# Altium project Skayboard.PrjPcb
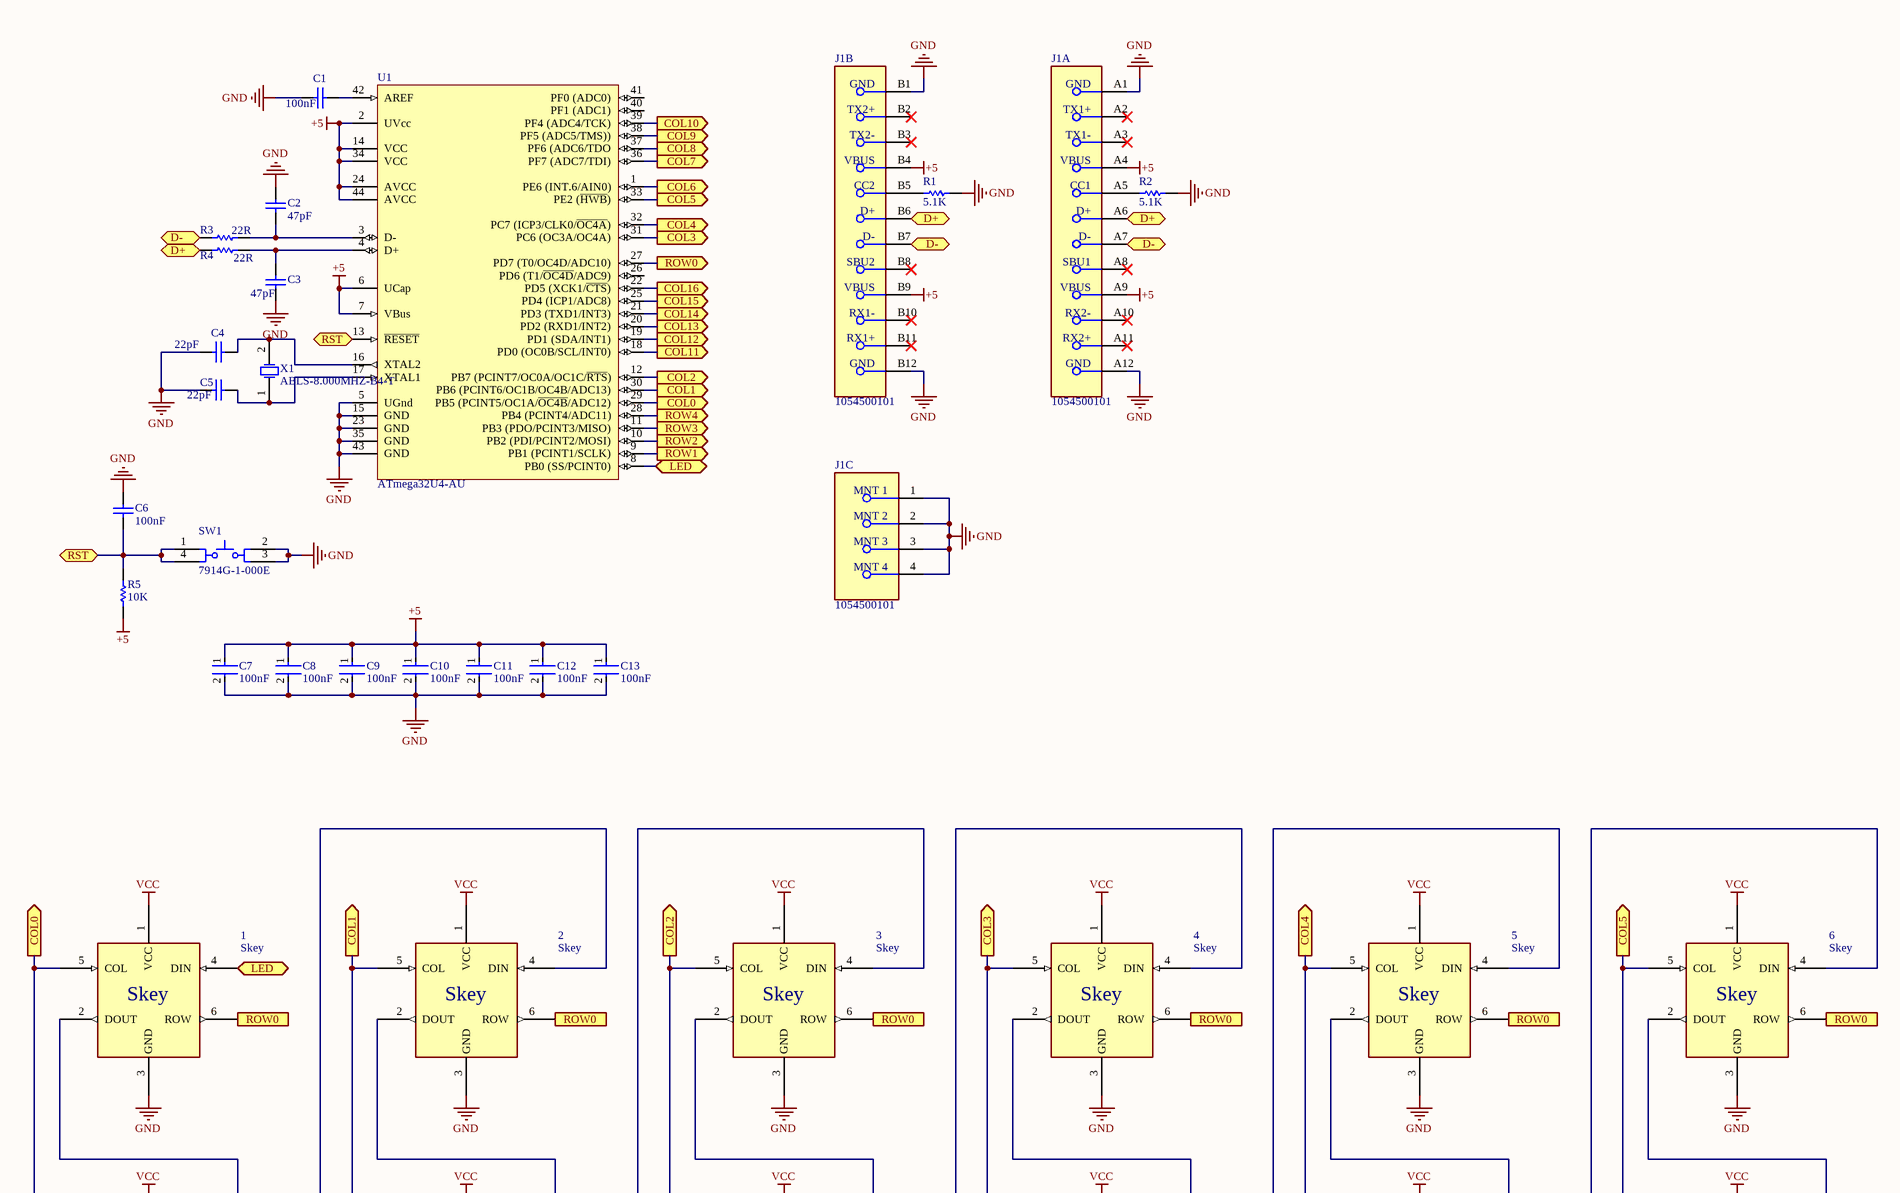
[diagram p0: SkayboardRev2.SchDoc, top left]
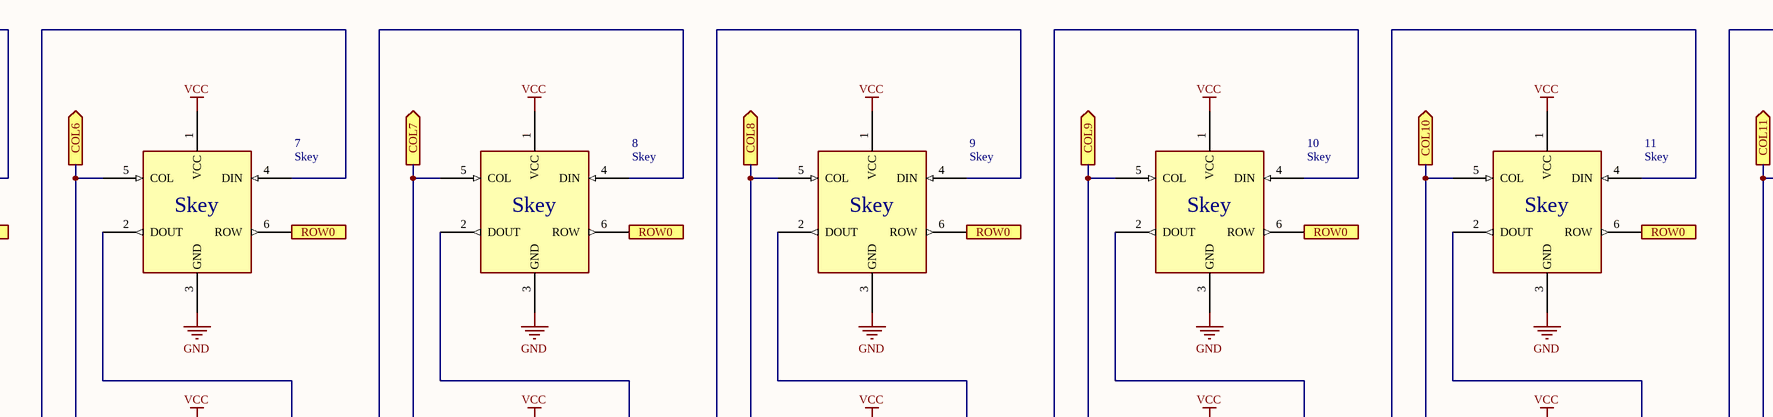
[diagram p1: SkayboardRev2.SchDoc, top middle]
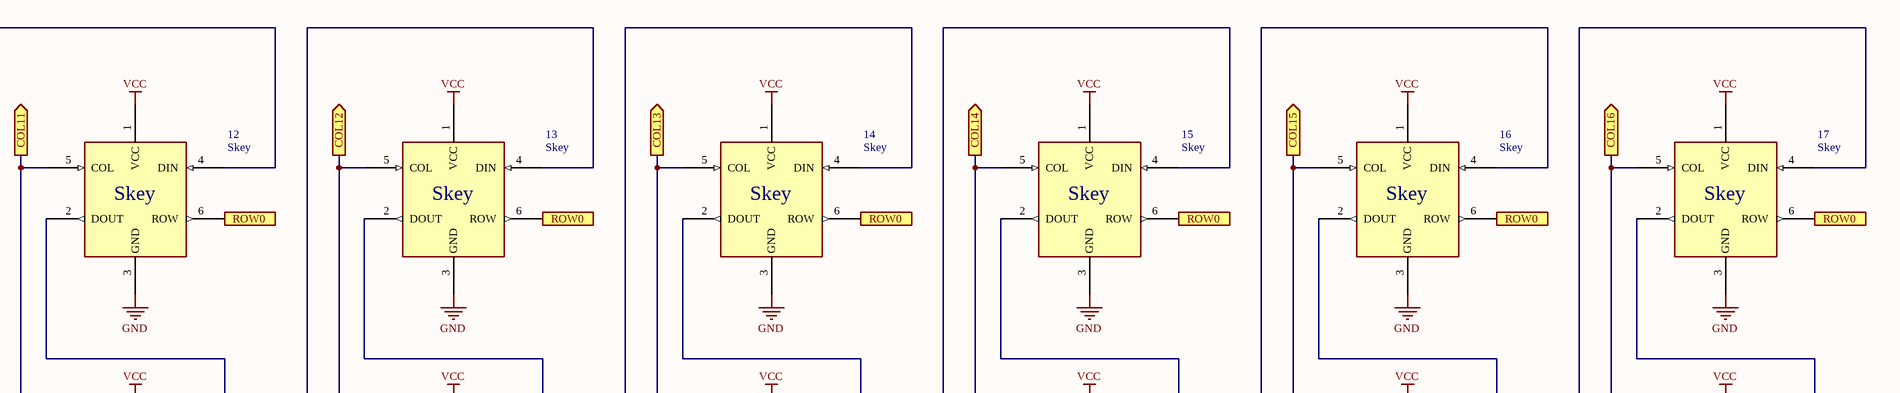
[diagram p2: SkayboardRev2.SchDoc, top right]
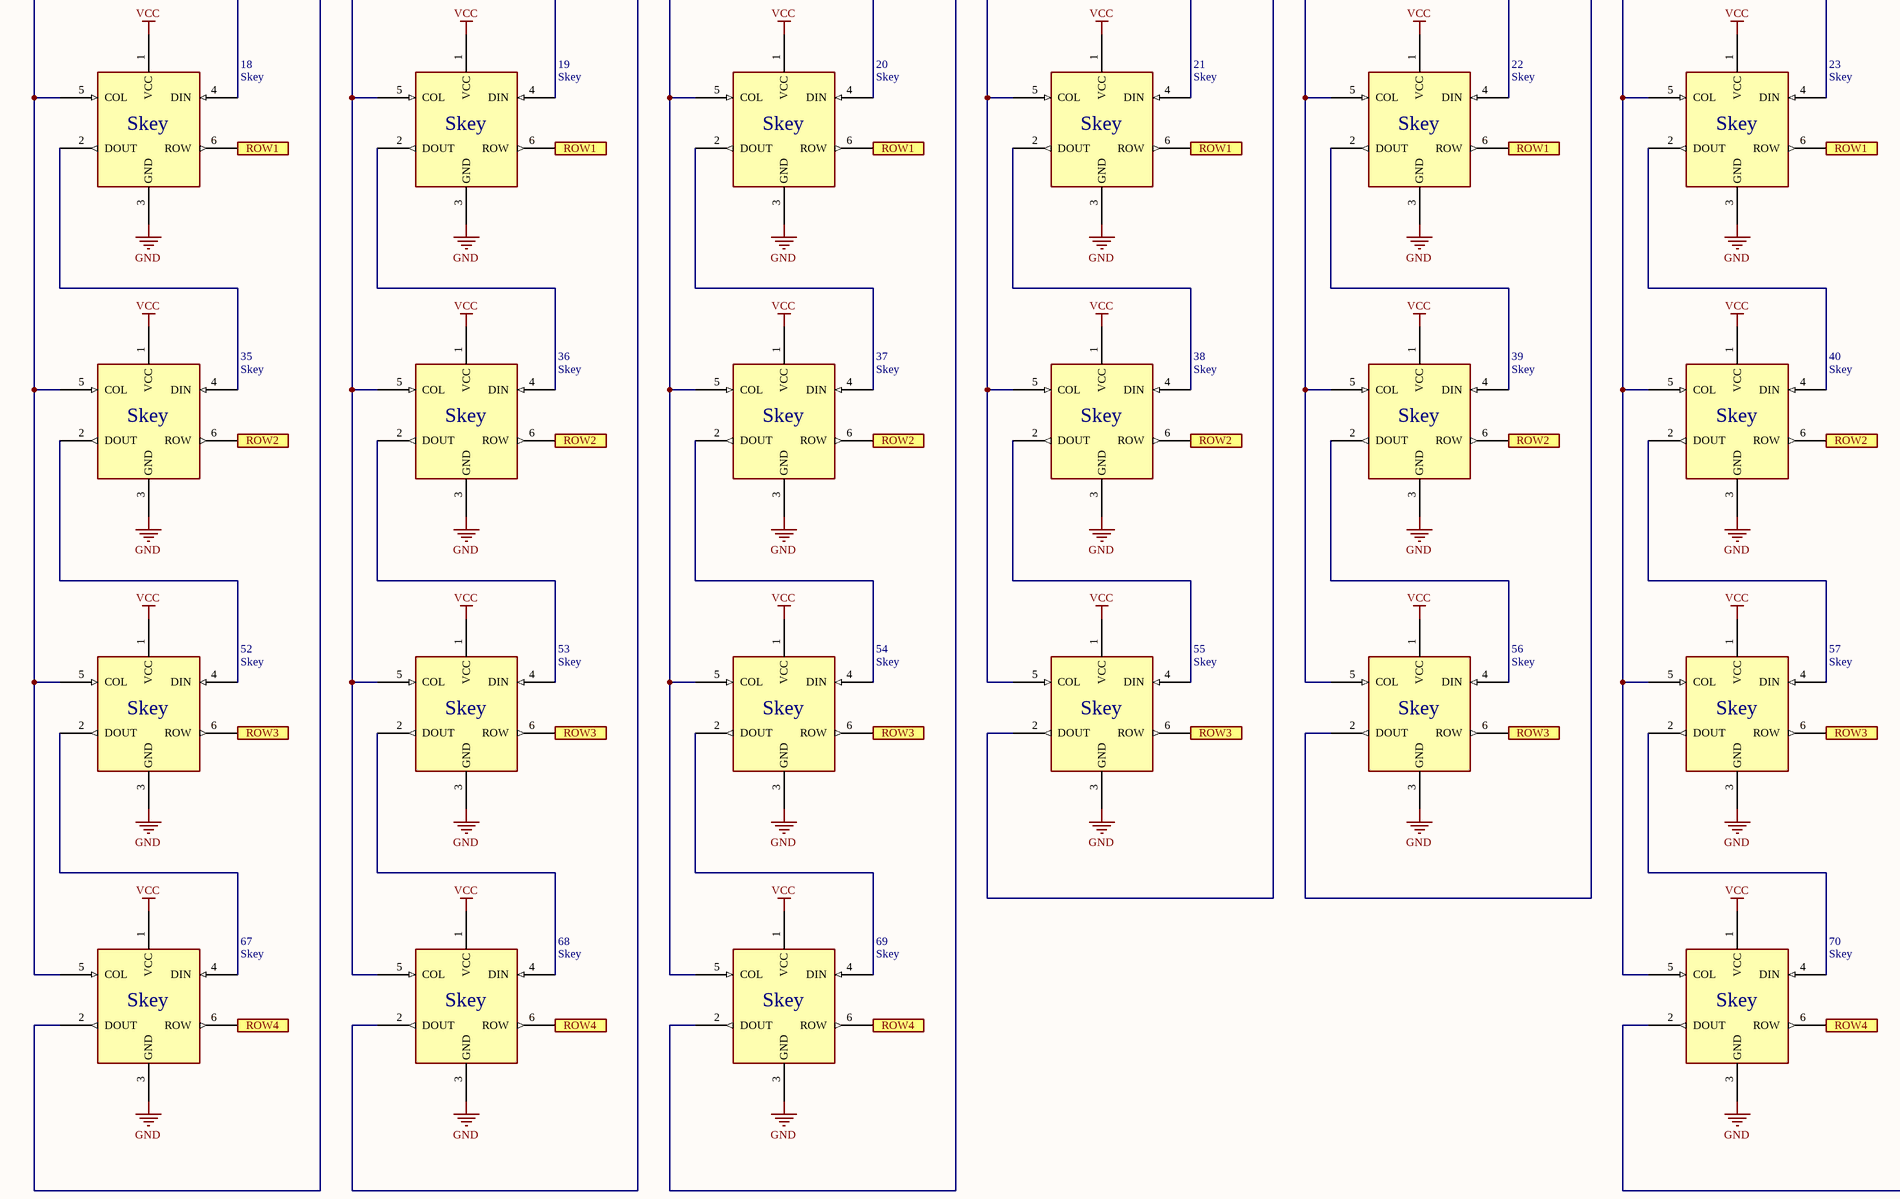
[diagram p3: SkayboardRev2.SchDoc, bottom left]
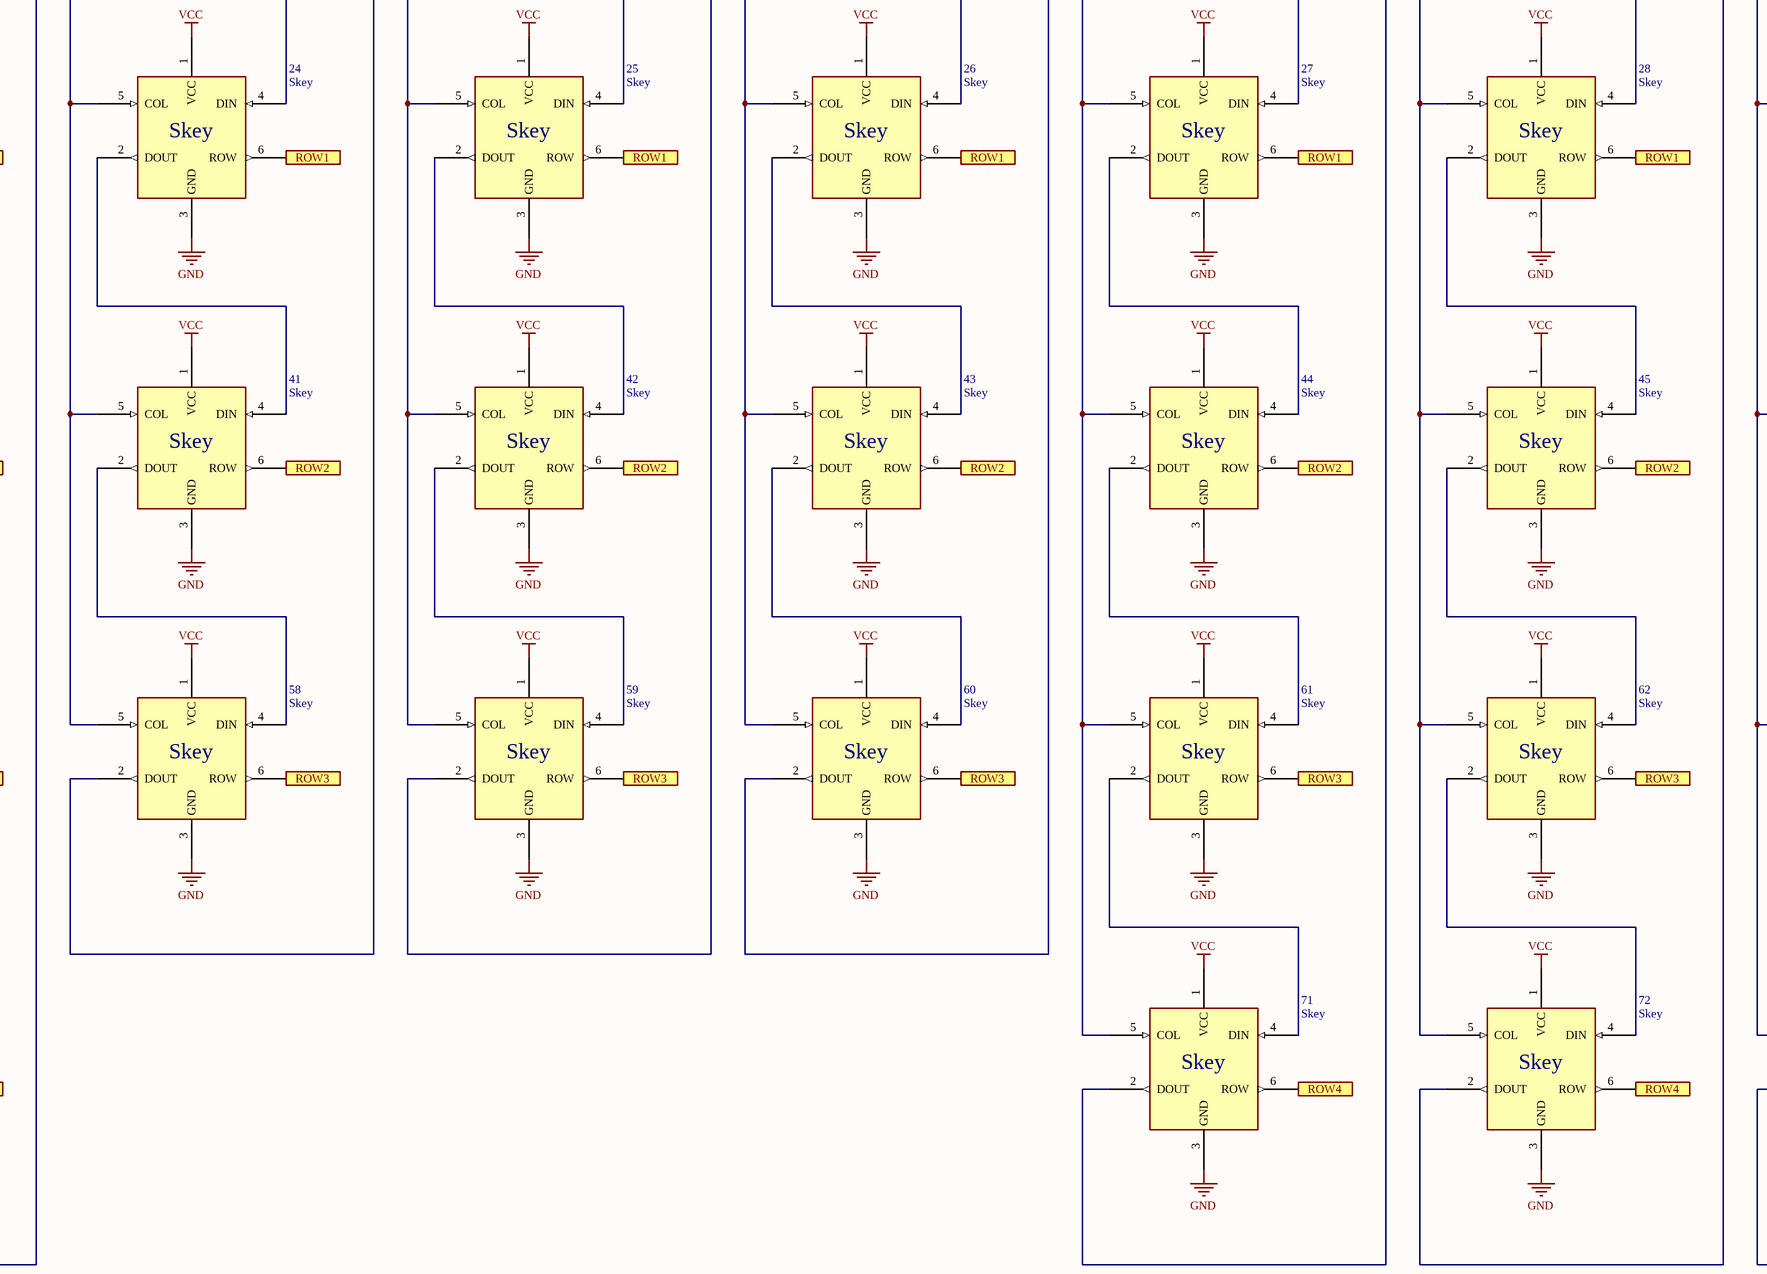
[diagram p4: SkayboardRev2.SchDoc, bottom middle]
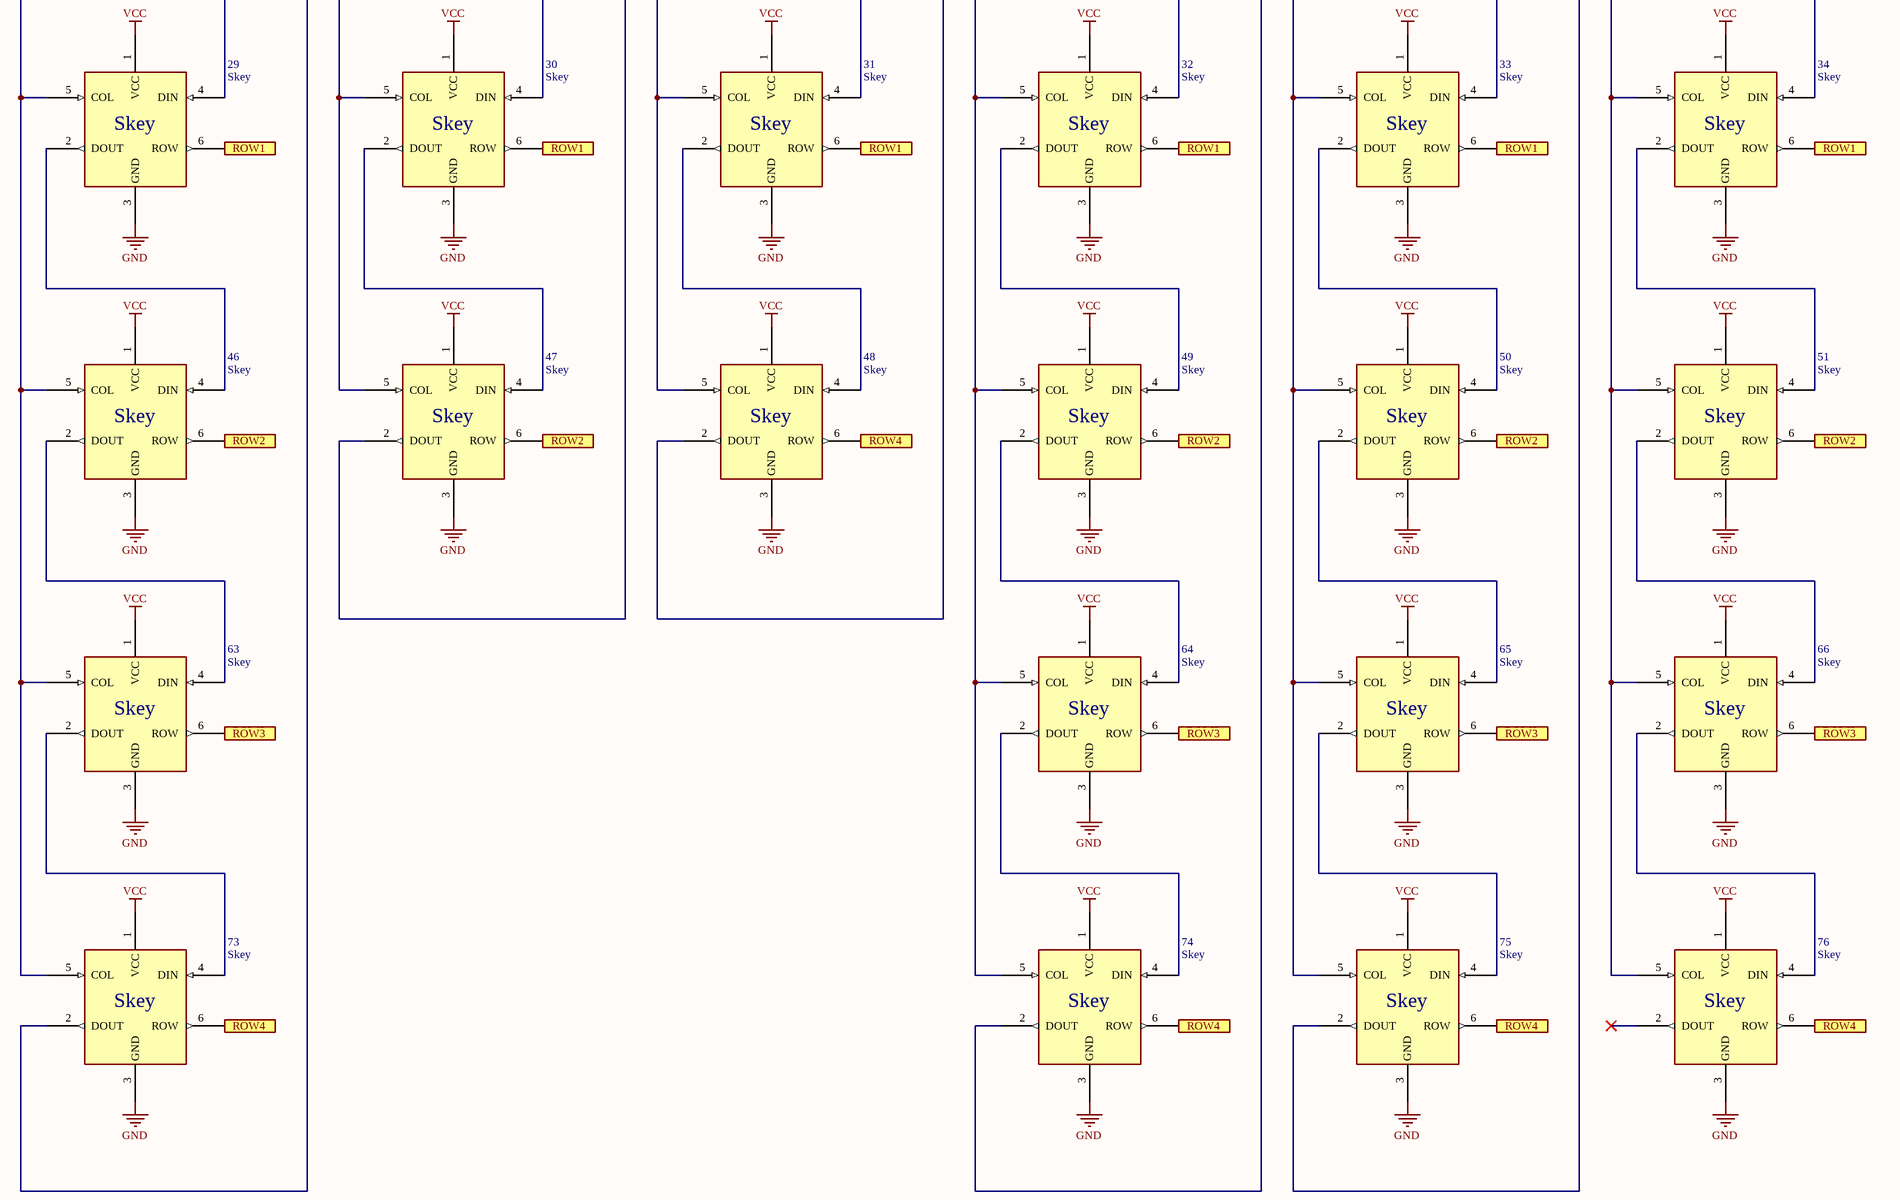
[diagram p5: SkayboardRev2.SchDoc, bottom right]
1 sheet, 98 parts. Net scope: flat (ports and power ports of the same name join across sheets).
Board file: SkayboardRev2.PcbDoc

## Sheet SkayboardRev2.SchDoc
size A0

### Parts
1  Skey  [Skey]
2  Skey  [Skey]
3  Skey  [Skey]
4  Skey  [Skey]
5  Skey  [Skey]
6  Skey  [Skey]
7  Skey  [Skey]
8  Skey  [Skey]
9  Skey  [Skey]
10  Skey  [Skey]
11  Skey  [Skey]
12  Skey  [Skey]
13  Skey  [Skey]
14  Skey  [Skey]
15  Skey  [Skey]
16  Skey  [Skey]
17  Skey  [Skey]
18  Skey  [Skey]
19  Skey  [Skey]
20  Skey  [Skey]
21  Skey  [Skey]
22  Skey  [Skey]
23  Skey  [Skey]
24  Skey  [Skey]
25  Skey  [Skey]
26  Skey  [Skey]
27  Skey  [Skey]
28  Skey  [Skey]
29  Skey  [Skey]
30  Skey  [Skey]
31  Skey  [Skey]
32  Skey  [Skey]
33  Skey  [Skey]
34  Skey  [Skey]
35  Skey  [Skey]
36  Skey  [Skey]
37  Skey  [Skey]
38  Skey  [Skey]
39  Skey  [Skey]
40  Skey  [Skey]
41  Skey  [Skey]
42  Skey  [Skey]
43  Skey  [Skey]
44  Skey  [Skey]
45  Skey  [Skey]
46  Skey  [Skey]
47  Skey  [Skey]
48  Skey  [Skey]
49  Skey  [Skey]
50  Skey  [Skey]
51  Skey  [Skey]
52  Skey  [Skey]
53  Skey  [Skey]
54  Skey  [Skey]
55  Skey  [Skey]
56  Skey  [Skey]
57  Skey  [Skey]
58  Skey  [Skey]
59  Skey  [Skey]
60  Skey  [Skey]
61  Skey  [Skey]
62  Skey  [Skey]
63  Skey  [Skey]
64  Skey  [Skey]
65  Skey  [Skey]
66  Skey  [Skey]
67  Skey  [Skey]
68  Skey  [Skey]
69  Skey  [Skey]
70  Skey  [Skey]
71  Skey  [Skey]
72  Skey  [Skey]
73  Skey  [Skey]
74  Skey  [Skey]
75  Skey  [Skey]
76  Skey  [Skey]
C1  100nF  [CAPC1050X55X23ML05T13]
C2  47pF  [CAPC1005X55X30ML05T10]
C3  47pF  [CAPC1005X55X30ML05T10]
C4  22pF  [CAPC1005X56X25NL10T15]
C5  22pF  [CAPC1005X56X25NL10T15]
C6  100nF  [CAPC1050X55X23ML05T13]
C7  100nF  [FP-C0402-BB-MFG]
C8  100nF  [FP-C0402-BB-MFG]
C9  100nF  [FP-C0402-BB-MFG]
C10  100nF  [FP-C0402-BB-MFG]
C11  100nF  [FP-C0402-BB-MFG]
C12  100nF  [FP-C0402-BB-MFG]
C13  100nF  [FP-C0402-BB-MFG]
J1  1054500101  [FP-1054500101-MFG]  (parts A,B,C of 3)
R1  5.1K  [RESC1005X40X25NL10T10]
R2  5.1K  [RESC1005X40X25NL10T10]
R3  22R  [RESC1005X40X25LL05T05]
R4  22R  [RESC1005X40X25LL05T05]
R5  10K  [RESC1005X40X25NL05T05]
SW1  7914G-1-000E  [BOUR-7914G-1-000E_V]
U1  ATmega32U4-AU  [44ML_M]
X1  ABLS-8.000MHZ-B4-T  [ABRA-ABLS-14.7456MHZ-B2-T_V]

### Ports
COL0 (out), COL1 (out), COL2 (out), COL3 (out), COL4 (out), COL5 (out), COL6 (out), COL7 (out), COL8 (out), COL9 (out), COL10 (out), COL11 (out), COL12 (out), COL13 (out), COL14 (out), COL15 (out), COL16 (out), D+ (bidir), D- (bidir), LED (bidir), ROW0 (out), ROW1 (out), ROW2 (out), ROW3 (out), ROW4 (out), RST (bidir)

### Nets
+5: C7.1 C8.1 C9.1 C10.1 C11.1 C12.1 C13.1 J1.A4(VBUS) J1.A9(VBUS) J1.B4(VBUS) J1.B9(VBUS) R5.1 U1.2(UVcc) U1.6(UCap) U1.7(VBus) U1.14(VCC) U1.24(AVCC) U1.34(VCC) U1.44(AVCC)
GND: 1.3(GND) 2.3(GND) 3.3(GND) 4.3(GND) 5.3(GND) 6.3(GND) 7.3(GND) 8.3(GND) 9.3(GND) 10.3(GND) 11.3(GND) 12.3(GND) 13.3(GND) 14.3(GND) 15.3(GND) 16.3(GND) 17.3(GND) 18.3(GND) 19.3(GND) 20.3(GND) 21.3(GND) 22.3(GND) 23.3(GND) 24.3(GND) 25.3(GND) 26.3(GND) 27.3(GND) 28.3(GND) 29.3(GND) 30.3(GND) 31.3(GND) 32.3(GND) 33.3(GND) 34.3(GND) 35.3(GND) 36.3(GND) 37.3(GND) 38.3(GND) 39.3(GND) 40.3(GND) 41.3(GND) 42.3(GND) 43.3(GND) 44.3(GND) 45.3(GND) 46.3(GND) 47.3(GND) 48.3(GND) 49.3(GND) 50.3(GND) 51.3(GND) 52.3(GND) 53.3(GND) 54.3(GND) 55.3(GND) 56.3(GND) 57.3(GND) 58.3(GND) 59.3(GND) 60.3(GND) 61.3(GND) 62.3(GND) 63.3(GND) 64.3(GND) 65.3(GND) 66.3(GND) 67.3(GND) 68.3(GND) 69.3(GND) 70.3(GND) 71.3(GND) 72.3(GND) 73.3(GND) 74.3(GND) 75.3(GND) 76.3(GND) C1.1 C2.2 C3.1 C4.1 C5.1 C6.2 C7.2 C8.2 C9.2 C10.2 C11.2 C12.2 C13.2 J1.1(MNT_1) J1.2(MNT_2) J1.3(MNT_3) J1.4(MNT_4) J1.A1(GND) J1.A12(GND) J1.B1(GND) J1.B12(GND) R1.2 R2.2 SW1.2(+) SW1.3(+) U1.5(UGnd) U1.15(GND) U1.23(GND) U1.35(GND) U1.43(GND)
VCC: 1.1(VCC) 2.1(VCC) 3.1(VCC) 4.1(VCC) 5.1(VCC) 6.1(VCC) 7.1(VCC) 8.1(VCC) 9.1(VCC) 10.1(VCC) 11.1(VCC) 12.1(VCC) 13.1(VCC) 14.1(VCC) 15.1(VCC) 16.1(VCC) 17.1(VCC) 18.1(VCC) 19.1(VCC) 20.1(VCC) 21.1(VCC) 22.1(VCC) 23.1(VCC) 24.1(VCC) 25.1(VCC) 26.1(VCC) 27.1(VCC) 28.1(VCC) 29.1(VCC) 30.1(VCC) 31.1(VCC) 32.1(VCC) 33.1(VCC) 34.1(VCC) 35.1(VCC) 36.1(VCC) 37.1(VCC) 38.1(VCC) 39.1(VCC) 40.1(VCC) 41.1(VCC) 42.1(VCC) 43.1(VCC) 44.1(VCC) 45.1(VCC) 46.1(VCC) 47.1(VCC) 48.1(VCC) 49.1(VCC) 50.1(VCC) 51.1(VCC) 52.1(VCC) 53.1(VCC) 54.1(VCC) 55.1(VCC) 56.1(VCC) 57.1(VCC) 58.1(VCC) 59.1(VCC) 60.1(VCC) 61.1(VCC) 62.1(VCC) 63.1(VCC) 64.1(VCC) 65.1(VCC) 66.1(VCC) 67.1(VCC) 68.1(VCC) 69.1(VCC) 70.1(VCC) 71.1(VCC) 72.1(VCC) 73.1(VCC) 74.1(VCC) 75.1(VCC) 76.1(VCC)
Net1_2: 1.2(DOUT) 18.4(DIN)
Net1_4: 1.4(DIN) U1.8(PB0_(SS/PCINT0)) ; port LED
Net1_5: 1.5(COL) 18.5(COL) 35.5(COL) 52.5(COL) 67.5(COL) U1.29(PB5_(PCINT5/OC1A/~{OC4B}/ADC12)) ; port COL0
Net1_6: 1.6(ROW) 2.6(ROW) 3.6(ROW) 4.6(ROW) 5.6(ROW) 6.6(ROW) 7.6(ROW) 8.6(ROW) 9.6(ROW) 10.6(ROW) 11.6(ROW) 12.6(ROW) 13.6(ROW) 14.6(ROW) 15.6(ROW) 16.6(ROW) 17.6(ROW) U1.27(PD7_(T0/OC4D/ADC10)) ; port ROW0
Net2_2: 2.2(DOUT) 19.4(DIN)
Net2_4: 2.4(DIN) 67.2(DOUT)
Net2_5: 2.5(COL) 19.5(COL) 36.5(COL) 53.5(COL) 68.5(COL) U1.30(PB6_(PCINT6/OC1B/OC4B/ADC13)) ; port COL1
Net3_2: 3.2(DOUT) 20.4(DIN)
Net3_4: 3.4(DIN) 68.2(DOUT)
Net3_5: 3.5(COL) 20.5(COL) 37.5(COL) 54.5(COL) 69.5(COL) U1.12(PB7_(PCINT7/OC0A/OC1C/~{RTS})) ; port COL2
Net4_2: 4.2(DOUT) 21.4(DIN)
Net4_4: 4.4(DIN) 69.2(DOUT)
Net4_5: 4.5(COL) 21.5(COL) 38.5(COL) 55.5(COL) U1.31(PC6_(OC3A/OC4A)) ; port COL3
Net5_2: 5.2(DOUT) 22.4(DIN)
Net5_4: 5.4(DIN) 55.2(DOUT)
Net5_5: 5.5(COL) 22.5(COL) 39.5(COL) 56.5(COL) U1.32(PC7_(ICP3/CLK0/~{OC4A})) ; port COL4
Net6_2: 6.2(DOUT) 23.4(DIN)
Net6_4: 6.4(DIN) 56.2(DOUT)
Net6_5: 6.5(COL) 23.5(COL) 40.5(COL) 57.5(COL) 70.5(COL) U1.33(PE2_(~{HWB})) ; port COL5
Net7_2: 7.2(DOUT) 24.4(DIN)
Net7_4: 7.4(DIN) 70.2(DOUT)
Net7_5: 7.5(COL) 24.5(COL) 41.5(COL) 58.5(COL) U1.1(PE6_(INT.6/AIN0)) ; port COL6
Net8_2: 8.2(DOUT) 25.4(DIN)
Net8_4: 8.4(DIN) 58.2(DOUT)
Net8_5: 8.5(COL) 25.5(COL) 42.5(COL) 59.5(COL) U1.36(PF7_(ADC7/TDI)) ; port COL7
Net9_2: 9.2(DOUT) 26.4(DIN)
Net9_4: 9.4(DIN) 59.2(DOUT)
Net9_5: 9.5(COL) 26.5(COL) 43.5(COL) 60.5(COL) U1.37(PF6_(ADC6/TDO) ; port COL8
Net10_2: 10.2(DOUT) 27.4(DIN)
Net10_4: 10.4(DIN) 60.2(DOUT)
Net10_5: 10.5(COL) 27.5(COL) 44.5(COL) 61.5(COL) 71.5(COL) U1.38(PF5_(ADC5/TMS))) ; port COL9
Net11_2: 11.2(DOUT) 28.4(DIN)
Net11_4: 11.4(DIN) 71.2(DOUT)
Net11_5: 11.5(COL) 28.5(COL) 45.5(COL) 62.5(COL) 72.5(COL) U1.39(PF4_(ADC4/TCK)) ; port COL10
Net12_2: 12.2(DOUT) 29.4(DIN)
Net12_4: 12.4(DIN) 72.2(DOUT)
Net12_5: 12.5(COL) 29.5(COL) 46.5(COL) 63.5(COL) 73.5(COL) U1.18(PD0_(OC0B/SCL/INT0)) ; port COL11
Net13_2: 13.2(DOUT) 30.4(DIN)
Net13_4: 13.4(DIN) 73.2(DOUT)
Net13_5: 13.5(COL) 30.5(COL) 47.5(COL) U1.19(PD1_(SDA/INT1)) ; port COL12
Net14_2: 14.2(DOUT) 31.4(DIN)
Net14_4: 14.4(DIN) 47.2(DOUT)
Net14_5: 14.5(COL) 31.5(COL) 48.5(COL) U1.20(PD2_(RXD1/INT2)) ; port COL13
Net15_2: 15.2(DOUT) 32.4(DIN)
Net15_4: 15.4(DIN) 48.2(DOUT)
Net15_5: 15.5(COL) 32.5(COL) 49.5(COL) 64.5(COL) 74.5(COL) U1.21(PD3_(TXD1/INT3)) ; port COL14
Net16_2: 16.2(DOUT) 33.4(DIN)
Net16_4: 16.4(DIN) 74.2(DOUT)
Net16_5: 16.5(COL) 33.5(COL) 50.5(COL) 65.5(COL) 75.5(COL) U1.25(PD4_(ICP1/ADC8)) ; port COL15
Net17_2: 17.2(DOUT) 34.4(DIN)
Net17_4: 17.4(DIN) 75.2(DOUT)
Net17_5: 17.5(COL) 34.5(COL) 51.5(COL) 66.5(COL) 76.5(COL) U1.22(PD5_(XCK1/~{CTS})) ; port COL16
Net18_2: 18.2(DOUT) 35.4(DIN)
Net18_6: 18.6(ROW) 19.6(ROW) 20.6(ROW) 21.6(ROW) 22.6(ROW) 23.6(ROW) 24.6(ROW) 25.6(ROW) 26.6(ROW) 27.6(ROW) 28.6(ROW) 29.6(ROW) 30.6(ROW) 31.6(ROW) 32.6(ROW) 33.6(ROW) 34.6(ROW) U1.9(PB1_(PCINT1/SCLK)) ; port ROW1
Net19_2: 19.2(DOUT) 36.4(DIN)
Net20_2: 20.2(DOUT) 37.4(DIN)
Net21_2: 21.2(DOUT) 38.4(DIN)
Net22_2: 22.2(DOUT) 39.4(DIN)
Net23_2: 23.2(DOUT) 40.4(DIN)
Net24_2: 24.2(DOUT) 41.4(DIN)
Net25_2: 25.2(DOUT) 42.4(DIN)
Net26_2: 26.2(DOUT) 43.4(DIN)
Net27_2: 27.2(DOUT) 44.4(DIN)
Net28_2: 28.2(DOUT) 45.4(DIN)
Net29_2: 29.2(DOUT) 46.4(DIN)
Net30_2: 30.2(DOUT) 47.4(DIN)
Net31_2: 31.2(DOUT) 48.4(DIN)
Net32_2: 32.2(DOUT) 49.4(DIN)
Net33_2: 33.2(DOUT) 50.4(DIN)
Net34_2: 34.2(DOUT) 51.4(DIN)
Net35_2: 35.2(DOUT) 52.4(DIN)
Net35_6: 35.6(ROW) 36.6(ROW) 37.6(ROW) 38.6(ROW) 39.6(ROW) 40.6(ROW) 41.6(ROW) 42.6(ROW) 43.6(ROW) 44.6(ROW) 45.6(ROW) 46.6(ROW) 47.6(ROW) 49.6(ROW) 50.6(ROW) 51.6(ROW) U1.10(PB2_(PDI/PCINT2/MOSI)) ; port ROW2
Net36_2: 36.2(DOUT) 53.4(DIN)
Net37_2: 37.2(DOUT) 54.4(DIN)
Net38_2: 38.2(DOUT) 55.4(DIN)
Net39_2: 39.2(DOUT) 56.4(DIN)
Net40_2: 40.2(DOUT) 57.4(DIN)
Net41_2: 41.2(DOUT) 58.4(DIN)
Net42_2: 42.2(DOUT) 59.4(DIN)
Net43_2: 43.2(DOUT) 60.4(DIN)
Net44_2: 44.2(DOUT) 61.4(DIN)
Net45_2: 45.2(DOUT) 62.4(DIN)
Net46_2: 46.2(DOUT) 63.4(DIN)
Net48_6: 48.6(ROW) 67.6(ROW) 68.6(ROW) 69.6(ROW) 70.6(ROW) 71.6(ROW) 72.6(ROW) 73.6(ROW) 74.6(ROW) 75.6(ROW) 76.6(ROW) U1.28(PB4_(PCINT4/ADC11)) ; port ROW4
Net49_2: 49.2(DOUT) 64.4(DIN)
Net50_2: 50.2(DOUT) 65.4(DIN)
Net51_2: 51.2(DOUT) 66.4(DIN)
Net52_2: 52.2(DOUT) 67.4(DIN)
Net52_6: 52.6(ROW) 53.6(ROW) 54.6(ROW) 55.6(ROW) 56.6(ROW) 57.6(ROW) 58.6(ROW) 59.6(ROW) 60.6(ROW) 61.6(ROW) 62.6(ROW) 63.6(ROW) 64.6(ROW) 65.6(ROW) 66.6(ROW) U1.11(PB3_(PDO/PCINT3/MISO)) ; port ROW3
Net53_2: 53.2(DOUT) 68.4(DIN)
Net54_2: 54.2(DOUT) 69.4(DIN)
Net57_2: 57.2(DOUT) 70.4(DIN)
Net61_2: 61.2(DOUT) 71.4(DIN)
Net62_2: 62.2(DOUT) 72.4(DIN)
Net63_2: 63.2(DOUT) 73.4(DIN)
Net64_2: 64.2(DOUT) 74.4(DIN)
Net65_2: 65.2(DOUT) 75.4(DIN)
Net66_2: 66.2(DOUT) 76.4(DIN)
NetC1_2: C1.2 U1.42(AREF)
NetC2_1: C2.1 R3.1 U1.3(D-)
NetC3_2: C3.2 R4.1 U1.4(D+)
NetC4_2: C4.2 U1.16(XTAL2) X1.2(X2)
NetC5_2: C5.2 U1.17(XTAL1) X1.1(X1)
NetC6_1: C6.1 R5.2 SW1.1(-) SW1.4(-) U1.13(~{RESET}) ; port RST
NetJ1_A5: J1.A5(CC1) R2.1
NetJ1_A6: J1.A6(D+) J1.B6(D+) R4.2 ; port D+
NetJ1_A7: J1.A7(D-) J1.B7(D-) R3.2 ; port D-
NetJ1_B5: J1.B5(CC2) R1.1

Not connected (* = marked no-connect by the designer): 76 2(DOUT)*; J1 A2(TX1+)* A3(TX1-)* A8(SBU1)* A10(RX2-)* A11(RX2+)* B2(TX2+)* B3(TX2-)* B8(SBU2)* B10(RX1-)* B11(RX1+)*; U1 26(PD6_(T1/~{OC4D}/ADC9)) 40(PF1_(ADC1)) 41(PF0_(ADC0))

### Notes on the sheet
- Title
- Size:
- Date:
- File:
- A0
- Number:
- Time:
- Revision:
- Sheet
- of

### Library data of the parts
1-76 = Skey: Skaytacium's keyboard's key's symbol
C1 C6 = CMP-2000-05439-1: Chip Capacitor, 100 nF, +/- 10%, 16 V, -55 to 125 degC, 0402 (1005 Metric), RoHS, Tape and Reel; Manufacturer: Samsung Electro-Mechanics; Capacitance: 100000pF; Dielectric: X7R; Rated Voltage: 16V; Case Size/Dimension: 0402; Tolerance (%): ±10%; Manufacturer URL: http://www.samsungsem.com/global/index.jsp; Datasheet URL: https://datasheet.ciiva.com/29198/458718-da-01-en-vs-kondensator-0402-29198423.pdf; Datasheet Version: Nov-10
C2 C3 = CMP-2008-03283-1: Part Number: C0402C470J5GACTU; Manufacturer: Kemet
C4 C5 = CMP-2008-02613-1: Part Number: 04025A220JAT2A; Manufacturer: AVX Interconnect / Elco
C7-C13 = CMP-03020-023811-1: CAP CER 0.1UF 10V X5R 0402; Manufacturer: Kemet; Manufacturer Part Number: C0402C104K8PACTU; Material: Ceramic; Capacitance: 0.10 μF; Temperature Coefficient: 15%; Tolerance: 0.1; Value: 0.10 μF; Package: C0402-BB; Temperature: -55°C to +125°C; ComponentLink2Description: Datasheet; Temperature Characteristic: X5R; Device Class L1: Passive Components; Height: 0.55mm; Lead Free: Yes; ComponentLink2URL: https://content.kemet.com/datasheets/KEM_C1002_X7R_SMD.pdf; Device Class L2: Capacitors; Temperature Range Low: -55°C; Temperature Range High: +125°C; RoHS: TRUE; Octopart: https://octopart.com/c0402c104k8pactu-kemet-140039; Automotive: No; Mouser Description: Capacitor 100 nF 10 VDC 0402; Category: Cap; Voltage Rating: 10 V; Digikey Description: CAP CER 0.1UF 10V X5R 0402; Ipc Land Pattern Name: CAPC10050X50; Device Class L3: Ceramic Capacitors
J1 = CMP-04767-000004-1: CONN RCP USB3.1 TYPEC 24P SMD RA; Manufacturer: Molex; Number Of Contacts: 24; Voltage Rating: 30V; Shielding: true; Is Female: yes; Current Rating: 0.25/1.25/5A; Pitch: 0.5mm; Conn Orientation: Right Angle; Package: 0; Height: 3.44mm; Footprint Url: https://www.molex.com/pdm_docs/sd/1054500101_sd.pdf; Device Class L1: Connectors; Category: Conn; Device Class L2: USB Connectors; Digikey Description: CONN RCP USB3.1 TYPEC 24P SMD RA; Contact Material: Gold,Nickel; Mouser Description: USB Shielded I/O Receptacle; Type C; Right Angle; Surface Mount; Gold over Nickel; ComponentLink2Description: Datasheet; Lead Free: Yes; Automotive: No; Temperature Range High: +85°C; RoHS: TRUE; Octopart: https://octopart.com/105450-0101-molex-68082325; ComponentLink2URL: https://www.molex.com/webdocs/datasheets/pdf/en-us/1054500101_IO_CONNECTORS.pdf; Temperature: -30°C to +85°C; Usb Standard: USB 3.1; Temperature Range Low: -30°C; Device Class L3: unset; Manufacturer Part Number: 1054500101
R1 R2 = CMP-2002-05812-1: Manufacturer: Panasonic; Part Number: ERA-2AEB512X
R3 R4 = CMP-2002-08382-1: Manufacturer: Vishay Dale; Part Number: CRCW040222R0FKED
R5 = CMP-2002-01183-1: Part Number: ERT-J0ER103J; Manufacturer: Panasonic
SW1 = CMP-2000-05692-1: SPST Gull Wing Sealed Key Switch, 100 mA, 16 V, -55 to 125 degC, 4-Pin SMD, RoHS, Tape and Reel; Manufacturer: Bourns; COO: TW; Actuator Length: 1.65mm; Maximum Contact Resistance: 100mOhm; Ground Terminal: No; Mechanical Life: 100000Cycles; Contact Rating @ Voltage: 0.1A; Illumination Type: N/R; Body Orientation: Straight; Dielectric Strength: 250VAC; Maximum DC Voltage Rating: 16V; Base Material: Thermoplastic; Operating Force: 2.94N; Actuator Style: RoundButton; Switch Configuration: N.O.; Mounting: SurfaceMount,GullWing; Electrical Life: N/A; Seal Description: N/A; Datasheet Version: 08/2016; ECCN: EAR99; Product Weight: N/A; Seal Location: N/A; Actuator Color: N/A; Dimension: 5x6.2x4.19mm; Manufacturer URL: http://www.bourns.com/; Packaging: EmbossedTapeandReel; RoHS: Yes; Part No: 7914G-1-000E; Pole Throw Configuration: SPST; Supplier: Bourns; Type: KeySwitch; Mounting Technology: SurfaceMount; Datasheet URL: http://www.bourns.com/docs/Product-Datasheets/7914.pdf; Package Reference: 7914G-1-000E; Contact Material: Gold; Family: 7914; Housing Material: N/A; Minimum Insulation Resistance: 100MOhm; HTS: 8536509065; Contact Plating: N/A; Operating Temperature: -55to125C; Package Description: 4-Pin Surface Mount Device, Body 5 x 5 mm, Height 4.49 mm; Maximum AC Voltage Rating: 16V
U1 = CMP-0095-00285-2: 8-bit AVR Microcontroller, 2.7-5.5V, 16MHz, 32KB Flash, 1KB EEPROM, 2.5KB SRAM, USB Controller, 44-pin TQFP, Industrial Grade (-40°C to 85°C), Ext Osc; RevisionNote: DatasheetVersion updated. URLs added.; ComponentLink1Description: Manufacturer URL; PackageDescription: 44-Pin Plastic Thin Quad Flat Pack, 10 x 10 x 1.0 mm Body, 0.8 mm Pitch (TQFP); DatasheetVersion: revF, Nov-2010; ComponentLink2URL: http://www.atmel.com/dyn/resources/prod_documents/doc7766.pdf; ComponentLink1URL: http://www.atmel.com/; PackageReference: 44ML; ComponentLink2Description: ATmega16U4/32U4 Datasheet; PackageVersion: rev.G, Jul-2007; ComponentLink3URL: http://www.atmel.com/dyn/resources/prod_documents/7766S.pdf; ComponentLink3Description: ATmega16U4 ATmega32U4 Summary
X1 = CMP-2000-05726-1: Low Profile Crystal, 8.0 MHz, +/- 30 ppm, -20 to 70 degC, 2-Pin SMD, RoHS, Tape and Reel; Brand: ABRACON; Case Length: 11.4mm; Frequency Stability: 50PPM; ESR: 80Ohms; Case Height: 4.2mm; Tolerance: 30PPM; Frequency: 8MHz; Case Width: 4.7mm; Load Capacitance: 18pF; Datasheet Version: 04/2011; Termination Style: SMD/SMT; Dimensions: 4.7mmWx11.4mmLx4.2mmH; Packaging: Reel; Manufacturer: ABRACON; Package URL: http://www.abracon.com/Support/PackageDrawing/Resonators/ABLS-2D.pdf; Mounting Technology: SurfaceMount; Package Reference: ABLS-14.7456MHZ-B2-T; Product Category: Crystals; Package Description: 2-Pin Surface Mount Device, Body 11.4 x 4.7 mm; Package / Case: HC-49/US; Mounting Style: SMD/SMT; Operating Temperature Range: -20Cto+70C; Series: ABLS; Factory Pack Quantity: 1000; Datasheet URL: http://www.abracon.com/Resonators/abls.pdf; Manufacturer URL: http://www.abracon.com/; RoHS: Details; Type: LowProfileMicroprocessorCrystal